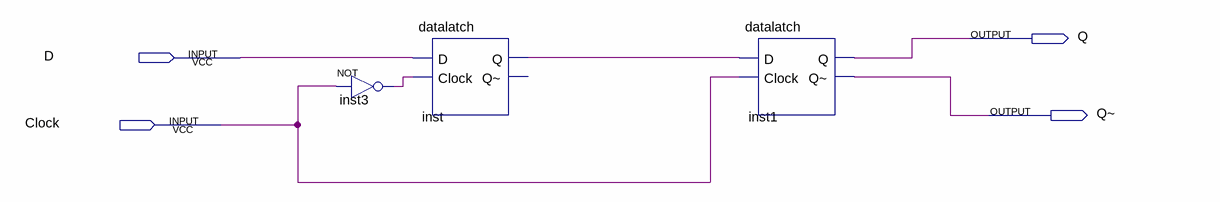
[diagram p0: schematic sheet]
// Quartus schematic posflip.bdf as structural Verilog: 3 symbols, 4 pins
module posflip (
  input  D,
  input  Clock,
  output Q,
  output \Q~ 
);

  wire inst3_out, inst_q;

  not inst3 (inst3_out, Clock);
  datalatch inst (.D(D), .Clock(inst3_out), .Q(inst_q));  // open: Q~
  datalatch inst1 (.D(inst_q), .Clock(Clock), .Q(Q), .\Q~ (\Q~ ));
endmodule
